# Altium schematic sheet RPI_schematics.SchDoc: Data Logger - RPI
size A4; DocumentNumber: DL-MB-3; SheetNumber: 3; SheetTotal: 11
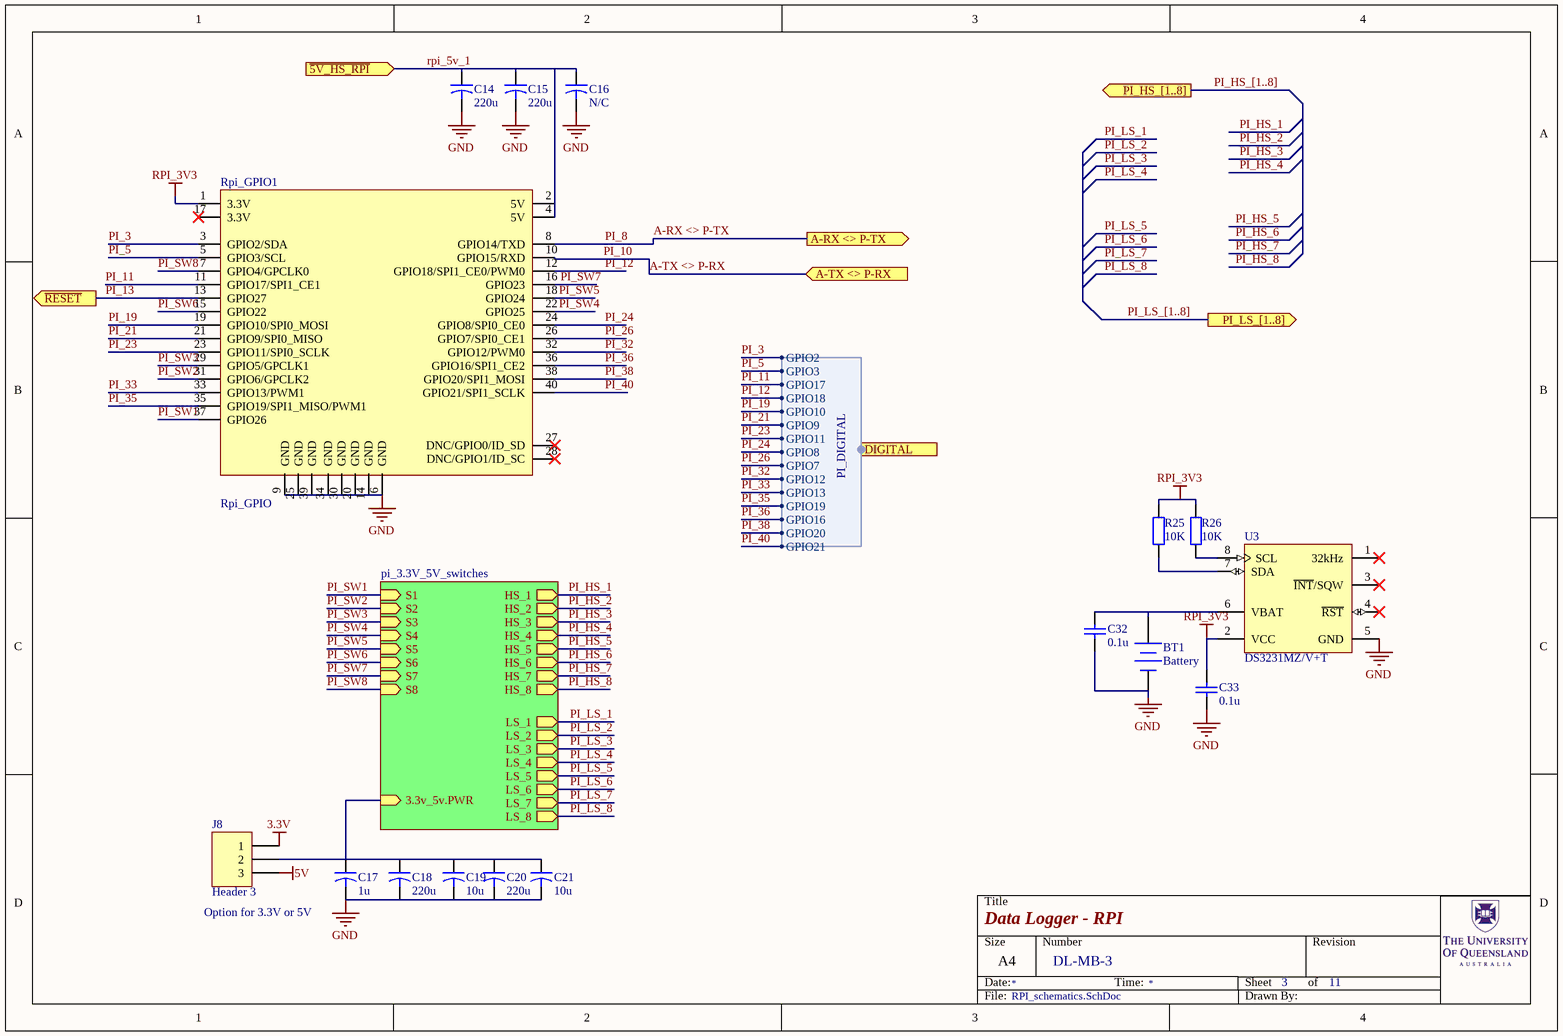
[diagram p0: RPI_schematics.SchDoc]

## Parts
BT1  Battery  [COIN-2032]
C14  220u  [CAPR5-4X5]
C15  220u  [CAPAE9083X80M]
C16  N/C  [CAPR5-4X5]
C17  1u  [CAPR5-4X5]
C18  220u  [CAPAE9083X80M]
C19  10u  [CAPR5-4X5]
C20  220u  [CAPR5-4X5]
C21  10u  [CAPR5-4X5]
C32  0.1u  [RES-1206_M]
C33  0.1u  [RES-1206_M]
J8  Header 3  [HDR1X3]
R25  10K  [RES-1206_M]
R26  10K  [RES-1206_M]
Rpi_GPIO1  Rpi_GPIO  [RPI_Z_GPIO_HDR2X20]
U3  DS3231MZ/V+T  [S8MK+1_N]

## Sub-sheets
pi_3.3V_5V_switches = pi_3.3v_5v_switches.SchDoc: S1 (in), HS_1 (out), LS_1 (out), S2 (in), S3 (in), S4 (in), S5 (in), S6 (in), S7 (in), S8 (in), HS_2 (out), HS_3 (out), HS_4 (out), HS_5 (out), HS_6 (out), HS_7 (out), HS_8 (out), LS_2 (out), LS_3 (out), LS_4 (out), LS_5 (out), LS_6 (out), LS_7 (out), LS_8 (out), 3.3v_5v.PWR (in)

## Ports
A-RX <> P-TX (out), A-TX <> P-RX (in), DIGITAL (in, harness PI_DIGITAL), PI_HS_[1..8] (out), PI_LS_[1..8] (out), ~{5V_HS_RPI} (in), ~{RESET} (out)

## Harnesses
PI_DIGITAL: GPIO2, GPIO3, GPIO17, GPIO18, GPIO10, GPIO9, GPIO11, GPIO8, GPIO7, GPIO12, GPIO13, GPIO19, GPIO16, GPIO20, GPIO21

## Nets
3.3V: J8.1
5V: J8.3
GND: BT1.2(-) C14.2 C15.2 C16.2 C17.2 C18.2 C19.2 C20.2 C21.2 C32.2 C33.2 Rpi_GPIO1.6(GND) Rpi_GPIO1.9(GND) Rpi_GPIO1.14(GND) Rpi_GPIO1.20(GND) Rpi_GPIO1.25(GND) Rpi_GPIO1.30(GND) Rpi_GPIO1.34(GND) Rpi_GPIO1.39(GND) U3.5(GND)
RPI_3V3: C33.1 R25.1 R26.1 Rpi_GPIO1.1(3.3V) U3.2(VCC)
A-RX <> P-TX: Rpi_GPIO1.8(GPIO14/TXD) ; port A-RX <> P-TX  [also labelled PI_8]
A-TX <> P-RX: Rpi_GPIO1.10(GPIO15/RXD) ; port A-TX <> P-RX  [also labelled PI_10]
PI_3: Rpi_GPIO1.3(GPIO2/SDA) ; port DIGITAL.GPIO2
PI_5: Rpi_GPIO1.5(GPIO3/SCL) ; port DIGITAL.GPIO3
PI_11: Rpi_GPIO1.11(GPIO17/SPI1_CE1) ; port DIGITAL.GPIO17
PI_12: Rpi_GPIO1.12(GPIO18/SPI1_CE0/PWM0) ; port DIGITAL.GPIO18
PI_13: Rpi_GPIO1.13(GPIO27) ; port ~{RESET}
PI_19: Rpi_GPIO1.19(GPIO10/SPI0_MOSI) ; port DIGITAL.GPIO10
PI_21: Rpi_GPIO1.21(GPIO9/SPI0_MISO) ; port DIGITAL.GPIO9
PI_23: Rpi_GPIO1.23(GPIO11/SPI0_SCLK) ; port DIGITAL.GPIO11
PI_24: Rpi_GPIO1.24(GPIO8/SPI0_CE0) ; port DIGITAL.GPIO8
PI_26: Rpi_GPIO1.26(GPIO7/SPI0_CE1) ; port DIGITAL.GPIO7
PI_32: Rpi_GPIO1.32(GPIO12/PWM0) ; port DIGITAL.GPIO12
PI_33: Rpi_GPIO1.33(GPIO13/PWM1) ; port DIGITAL.GPIO13
PI_35: Rpi_GPIO1.35(GPIO19/SPI1_MISO/PWM1) ; port DIGITAL.GPIO19
PI_36: Rpi_GPIO1.36(GPIO16/SPI1_CE2) ; port DIGITAL.GPIO16
PI_38: Rpi_GPIO1.38(GPIO20/SPI1_MOSI) ; port DIGITAL.GPIO20
PI_40: Rpi_GPIO1.40(GPIO21/SPI1_SCLK) ; port DIGITAL.GPIO21
PI_HS_1: sheet pi_3.3V_5V_switches/HS_1
PI_HS_2: sheet pi_3.3V_5V_switches/HS_2
PI_HS_3: sheet pi_3.3V_5V_switches/HS_3
PI_HS_4: sheet pi_3.3V_5V_switches/HS_4
PI_HS_5: sheet pi_3.3V_5V_switches/HS_5
PI_HS_6: sheet pi_3.3V_5V_switches/HS_6
PI_HS_7: sheet pi_3.3V_5V_switches/HS_7
PI_HS_8: sheet pi_3.3V_5V_switches/HS_8
PI_LS_1: sheet pi_3.3V_5V_switches/LS_1
PI_LS_2: sheet pi_3.3V_5V_switches/LS_2
PI_LS_3: sheet pi_3.3V_5V_switches/LS_3
PI_LS_4: sheet pi_3.3V_5V_switches/LS_4
PI_LS_5: sheet pi_3.3V_5V_switches/LS_5
PI_LS_6: sheet pi_3.3V_5V_switches/LS_6
PI_LS_7: sheet pi_3.3V_5V_switches/LS_7
PI_LS_8: sheet pi_3.3V_5V_switches/LS_8
PI_SW1: Rpi_GPIO1.37(GPIO26) ; sheet pi_3.3V_5V_switches/S1
PI_SW2: Rpi_GPIO1.31(GPIO6/GPCLK2) ; sheet pi_3.3V_5V_switches/S2
PI_SW3: Rpi_GPIO1.29(GPIO5/GPCLK1) ; sheet pi_3.3V_5V_switches/S3
PI_SW4: Rpi_GPIO1.22(GPIO25) ; sheet pi_3.3V_5V_switches/S4
PI_SW5: Rpi_GPIO1.18(GPIO24) ; sheet pi_3.3V_5V_switches/S5
PI_SW6: Rpi_GPIO1.15(GPIO22) ; sheet pi_3.3V_5V_switches/S6
PI_SW7: Rpi_GPIO1.16(GPIO23) ; sheet pi_3.3V_5V_switches/S7
PI_SW8: Rpi_GPIO1.7(GPIO4/GPCLK0) ; sheet pi_3.3V_5V_switches/S8
rpi_5v_1: C14.1 C15.1 C16.1 Rpi_GPIO1.2(5V) Rpi_GPIO1.4(5V) ; port ~{5V_HS_RPI}
NetBT1_1: BT1.1(+) C32.1 U3.6(VBAT)
NetC17_1: C17.1 C18.1 C19.1 C20.1 C21.1 J8.2 ; sheet pi_3.3V_5V_switches/3.3v_5v.PWR
NetR25_2: R25.2 U3.7(SDA)
NetR26_2: R26.2 U3.8(SCL)

Not connected (* = marked no-connect by the designer): Rpi_GPIO1 17(3.3V)* 27(DNC/GPIO0/ID_SD)* 28(DNC/GPIO1/ID_SC)*; U3 1(32kHz)* 3(~{INT}/SQW)* 4(~{RST})*

## Buses and harness runs
bus PI_HS_[1..8] = port PI_HS_[1..8]
bus PI_LS_[1..8] = port PI_LS_[1..8]

## Notes on the sheet
- Option for 3.3V or 5V
- Title
- Size
- Date:
- A4
- Number
- Time:
- Sheet
- of
- Revision
- File:
- Drawn By:

## Library data of the parts
BT1 = Battery: Multicell Battery; PackageReference: COIN-2032; PackageDescription: Coin Battery; 2 Leads
C14-C21 = Cap Pol1: Capacitor; Publisher: Altium Limited; PackageDescription: Polarized Capacitor; 2 Leads
  C14 C20: Published: 23-Sep-02; Value: 220u; Link: https://au.rs-online.com/web/p/aluminium-capacitors/1918277/
  C15 C18: Published: 23-Sep-2002; Value: 220u
  C16: Published: 23-Sep-02; Value: N/C
  C17: Published: 23-Sep-02; Value: 1u; Link: https://au.rs-online.com/web/p/ceramic-multilayer-capacitors/6995137/
  C19 C21: Published: 23-Sep-02; Value: 10u; Link: https://au.rs-online.com/web/p/aluminium-capacitors/2244325/
C32 C33 = Cap Semi: Capacitor (Semiconductor SIM Model); Published: 8-Jun-2000; PackageReference: C1206; Publisher: Altium Limited; PackageDescription: Chip Capacitor; Value: 0.1u; LatestRevisionDate: 29-May-2009; LatestRevisionNote: IPC-7351 Footprint Added.
J8 = Header 3: Header, 3-Pin / RPI, 5V or 3V Power; LatestRevisionDate: 17-Jul-2002; LatestRevisionNote: Re-released for DXP Platform.; Publisher: Altium Limited
R25 R26 = Res2: Resistor; Published: 8-Jun-2000; LatestRevisionDate: 17-Jul-2002; LatestRevisionNote: Re-released for DXP Platform.; PackageReference: 1206; Publisher: Altium Limited; PackageDescription: Chip Resistor 1206 Case Size; Value: 10K
Rpi_GPIO1 = Rpi_GPIO_1: Header, 20-Pin, Dual row; LatestRevisionDate: 17-Jul-2002; LatestRevisionNote: Re-released for DXP Platform.; Publisher: Altium Limited
U3 = CMP-0254-00373-1: +/-5ppm, I2C Real-Time Clock with Internal MEMs Resonator, 8-Pin SO, -40 to 85 degC, Automotive Qualified, Pb-Free, Reel; DatasheetVersion: Rev 3, Dec-2011; ComponentLink2Description: Datasheet; ComponentLink2URL: http://datasheets.maxim-ic.com/en/ds/DS3231M.pdf; PackageVersion: revC, 2010; PackageReference: S8MK+1; Code_IPC: SOIC127P600-8; PackageDescription: 8-Pin Small-Outline IC, Narrow (0.15in), 1.27 mm Pitch, SOIC (N), Pb-Free; Code_JEDEC: MS-012-AA; ComponentLink3URL: http://pdfserv.maxim-ic.com/package_dwgs/21-0041.PDF; ComponentLink3Description: Package Specification; ComponentLink1Description: Manufacturer URL; ComponentLink1URL: http://www.maxim-ic.com